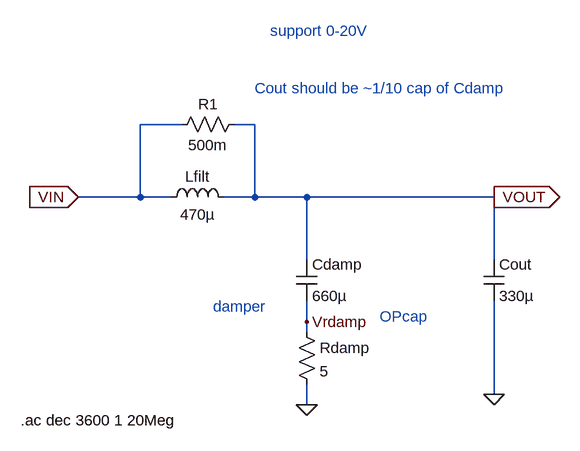
[diagram p0: schematic 12v.asc]
12v.asc, the LTspice schematic file:
Version 4
SHEET 1 968 680
WIRE -144 160 -208 160
WIRE -32 160 -64 160
WIRE -208 272 -208 160
WIRE -208 272 -304 272
WIRE -160 272 -208 272
WIRE -32 272 -32 160
WIRE -32 272 -80 272
WIRE 48 272 -32 272
WIRE 336 272 48 272
WIRE 48 368 48 272
WIRE 336 368 336 272
WIRE 48 464 48 432
WIRE 48 480 48 464
WIRE 336 576 336 432
WIRE 48 592 48 560
FLAG 48 592 0
FLAG 336 576 0
FLAG 48 464 Vrdamp
FLAG -304 272 VIN
IOPIN -304 272 In
FLAG 336 272 VOUT
IOPIN 336 272 Out
SYMBOL ind -176 288 R270
WINDOW 0 32 56 VTop 2
WINDOW 3 5 56 VBottom 2
SYMATTR InstName Lfilt
SYMATTR Value 470µ
SYMBOL cap 32 368 R0
SYMATTR InstName Cdamp
SYMATTR Value 660µ
SYMBOL res 32 464 R0
SYMATTR InstName Rdamp
SYMATTR Value 5
SYMBOL cap 320 368 R0
SYMATTR InstName Cout
SYMATTR Value 330µ
SYMBOL res -48 144 R90
WINDOW 0 0 56 VBottom 2
WINDOW 3 32 56 VTop 2
SYMATTR InstName R1
SYMATTR Value 500m
TEXT -8 16 Left 2 ;support 0-20V
TEXT -96 440 Left 2 ;damper
TEXT 160 456 Left 2 ;OPcap
TEXT -32 104 Left 2 ;Cout should be ~1/10 cap of Cdamp
TEXT -392 616 Left 2 !.ac dec 3600 1 20Meg

The netlist it stands for:
* 12v.asc
Lfilt VIN VOUT 470µ
Cdamp VOUT Vrdamp 660µ
Rdamp Vrdamp 0 5
Cout VOUT 0 330µ
R1 VOUT VIN 500m
* support 0-20V
* damper
* OPcap
* Cout should be ~1/10 cap of Cdamp
.ac dec 3600 1 20Meg
.backanno
.end